# Altium schematic sheet 19.SchDoc
size 297 x 209 mm
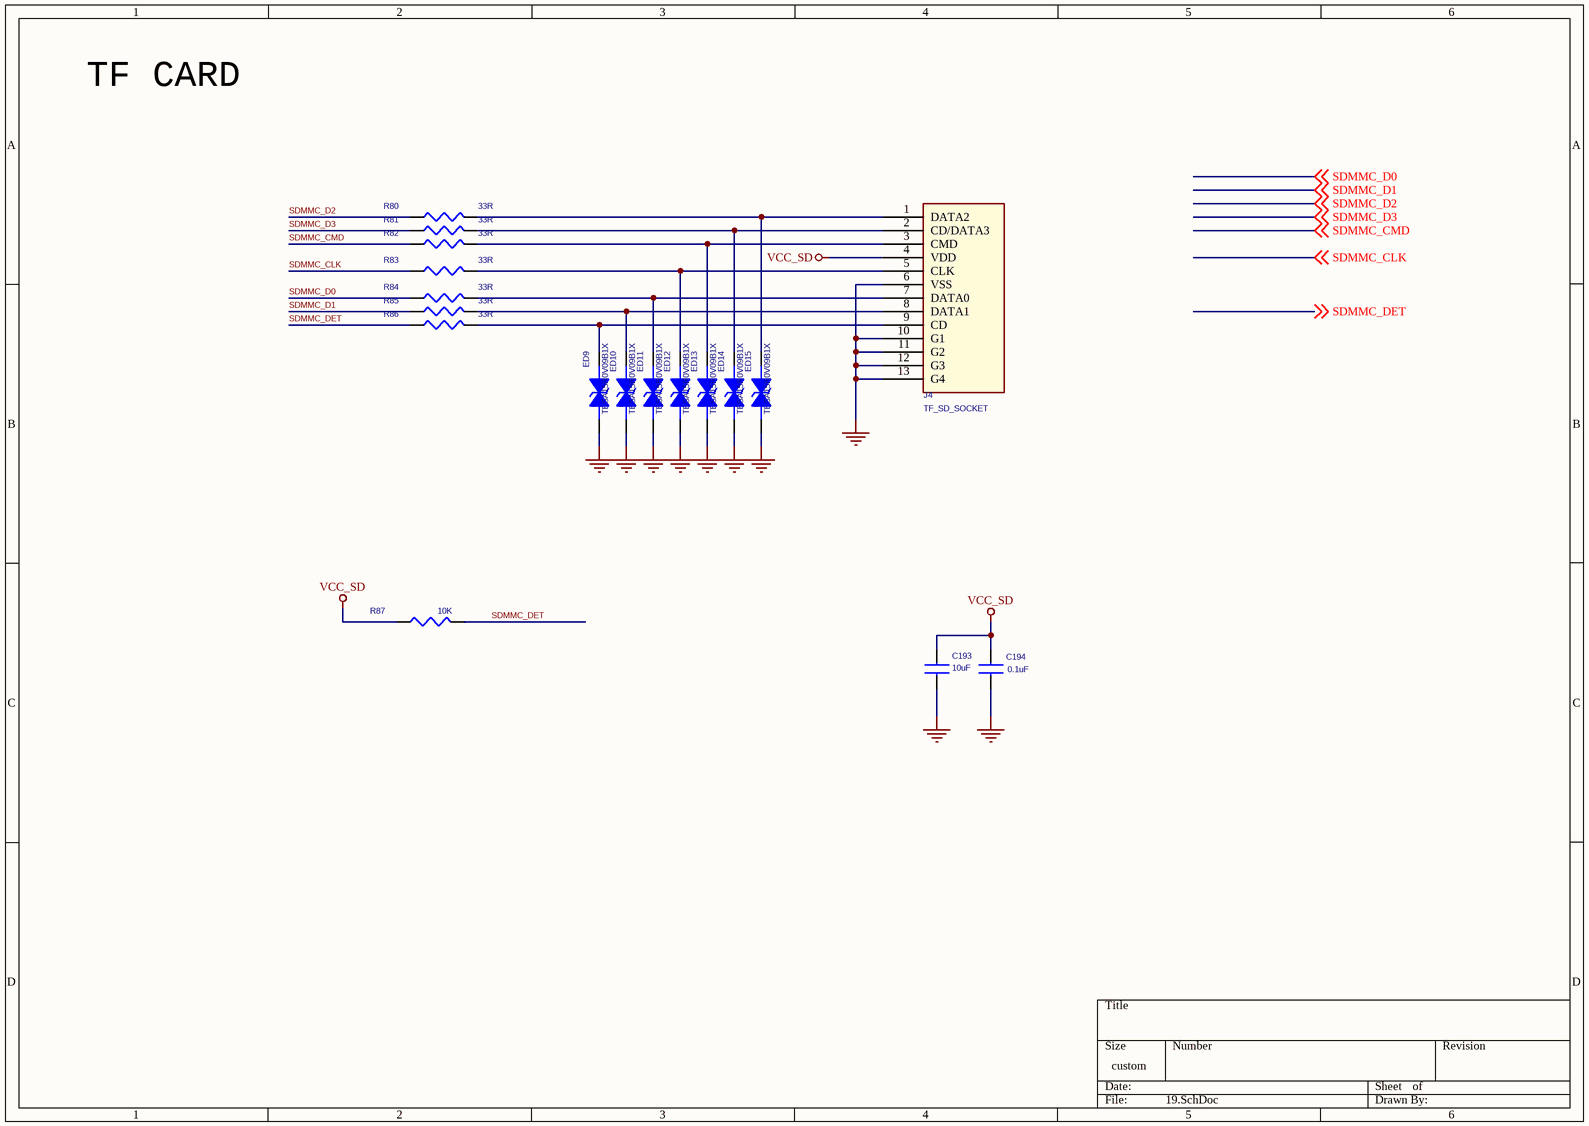
[diagram p0: 19.SchDoc]

## Parts
C193  10uF  [C0603]
C194  0.1uF  [C0603]
ED9  TESA15R0V09B1X  [E0402N]
ED10  TESA15R0V09B1X  [E0402N]
ED11  TESA15R0V09B1X  [E0402N]
ED12  TESA15R0V09B1X  [E0402N]
ED13  TESA15R0V09B1X  [E0402N]
ED14  TESA15R0V09B1X  [E0402N]
ED15  TESA15R0V09B1X  [E0402N]
J4  TF_SD_SOCKET  [TF-CARDKLJ07002]
R80  33R  [r0402]
R81  33R  [r0402]
R82  33R  [r0402]
R83  33R  [r0402]
R84  33R  [r0402]
R85  33R  [r0402]
R86  33R  [r0402]
R87  10K  [r0402]

## Nets
GND: C193.1 C194.2 ED9.2 ED10.2 ED11.2 ED12.2 ED13.2 ED14.2 ED15.2 J4.6(VSS) J4.10(G1) J4.11(G2) J4.12(G3) J4.13(G4)
VCC_SD: C193.2 C194.1 J4.4(VDD) R87.1
SDMMC_CLK: R83.1 ; off-sheet SDMMC_CLK
SDMMC_CMD: R82.1 ; off-sheet SDMMC_CMD
SDMMC_D0: R84.1 ; off-sheet SDMMC_D0
SDMMC_D1: R85.1 ; off-sheet SDMMC_D1
SDMMC_D2: R80.1 ; off-sheet SDMMC_D2
SDMMC_D3: R81.1 ; off-sheet SDMMC_D3
SDMMC_DET: R86.1 R87.2 ; off-sheet SDMMC_DET
NetED9_1: ED9.1 J4.9(CD) R86.2
NetED10_1: ED10.1 J4.8(DATA1) R85.2
NetED11_1: ED11.1 J4.7(DATA0) R84.2
NetED12_1: ED12.1 J4.5(CLK) R83.2
NetED13_1: ED13.1 J4.3(CMD) R82.2
NetED14_1: ED14.1 J4.2(CD/DATA3) R81.2
NetED15_1: ED15.1 J4.1(DATA2) R80.2

## Notes on the sheet
- TF CARD

## Library data of the parts
C193 = CAP NP_Dup3: CAP,MLCC,10uF,+/-10%,X5R,6.3V,SMD0805
C194 = CAP NP_Dup3: CAP,MLCC,100nF,+/-10%,X7R,6.3V,SMD0402
ED9-ED15 = TVS: ESD Component,5V,30P,SMD,0402
J4 = SD_SOCKET_0
R80-R87 = RESISTOR_1_Dup2